# Altium schematic sheet DiffAmp.SchDoc: High Speed Fully Diferential Amplifier
size A; DrawnBy: Enrique Morell; DocumentNumber: 4; Revision: v0.1; SheetNumber: 4; SheetTotal: 9
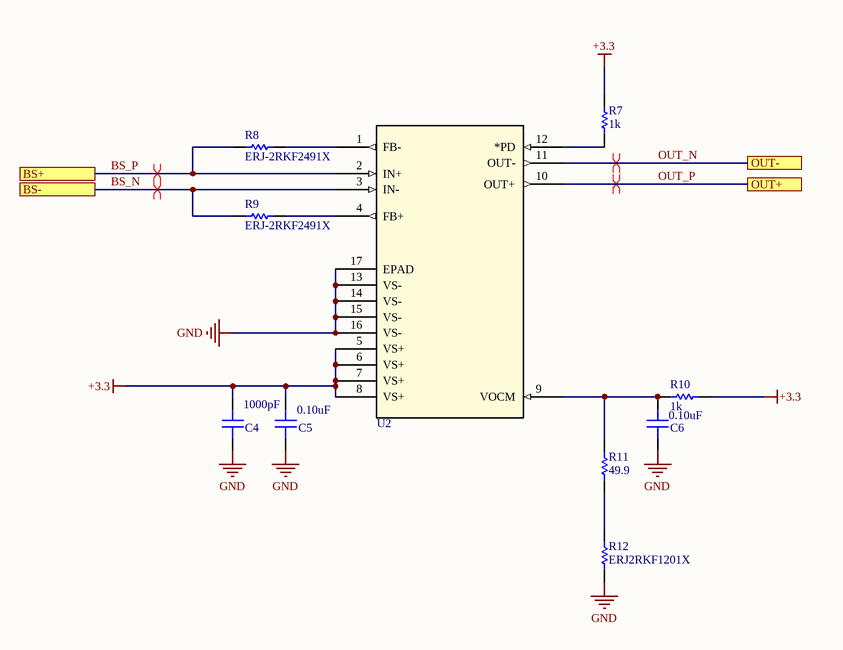
[diagram p0: DiffAmp.SchDoc]

## Parts
C4  1000pF  [CAP 0402/1005]
C5  0.10uF  [CAP 0402/1005]
C6  0.10uF  [CAP 0402/1005]
R7  1k  [RESC1005X40X25NL05T05]
R8  ERJ-2RKF2491X  [RESC1005X40X25ML05T05]
R9  ERJ-2RKF2491X  [RESC1005X40X25ML05T05]
R10  1k  [RESC1005X40X25NL05T05]
R11  49.9  [RESC1005X40X25NL05T05]
R12  ERJ2RKF1201X  [RESC1005X40X25ML05T05]
U2  THS4541IRGTT  [TI VQFN-16 (3x3)]  (value not drawn)

## Ports
BS+, BS-, OUT+, OUT-

## Nets
+3.3: C4.2 C5.2 R7.2 R10.1 U2.5(VS+) U2.6(VS+) U2.7(VS+) U2.8(VS+)
GND: C4.1 C5.1 C6.1 R12.1 U2.13(VS-) U2.14(VS-) U2.15(VS-) U2.16(VS-) U2.17(EPAD)
BS_N: R9.1 U2.3(IN-) ; port BS-
BS_P: R8.1 U2.2(IN+) ; port BS+
OUT_N: U2.11(OUT-) ; port OUT-
OUT_P: U2.10(OUT+) ; port OUT+
NetC6_2: C6.2 R10.2 R11.2 U2.9(VOCM)
NetR7_1: R7.1 U2.12(*PD)
NetR8_2: R8.2 U2.1(FB-)
NetR9_2: R9.2 U2.4(FB+)
NetR11_1: R11.1 R12.2

## Layout directives
differential pair: BS_N, BS_P, OUT_N, OUT_P

## Library data of the parts
C4 = C0402C102K3RACTU: CAP CER 1000PF 25V X7R 0402; Manufacturer: Kemet; TemperatureRange: -55C ~ 125C; Tolerance: 10%; Value: 1000pF; Part Number: C0402C102K3RACTU; PartId: 12420; Supplier 1: Digi-Key; Supplier Part Number 1: 399-1031-2-ND; ComponentLink1Description: Datasheet; ComponentLink1URL: http://www.kemet.com/docfinder?Partnumber=C0402C102K3RACTU; ComponentLink2Description: Digi-Key Listing; ComponentLink2URL: https://www.digikey.com/product-detail/en/kemet/C0402C102K3RACTU/399-1031-2-ND/411033; TemperatureCoefficient: X7R; Voltage: 25V; Price: 0.0037; Device Package: 0402 (1005 Metric)
C5 C6 = GRM155R71C104JA88D: CAP CER 0.1UF 16V X7R 0402; Manufacturer: Murata Electronics North America; TemperatureRange: -55C ~ 125C; Tolerance: 5%; Value: 0.10uF; Part Number: GRM155R71C104JA88D; PartId: 12366; Supplier 1: Digi-Key; Supplier Part Number 1: 490-6327-2-ND; ComponentLink1Description: Datasheet; ComponentLink1URL: http://www.murata.com/~/media/webrenewal/support/library/catalog/products/capacitor/mlcc/c02e.pdf; ComponentLink2Description: Digi-Key Listing; ComponentLink2URL: https://www.digikey.com/product-detail/en/murata-electronics-north-america/GRM155R71C104JA88D/490-6327-2-ND/2610891; TemperatureCoefficient: X7R; Voltage: 16V; Price: 0.0046; Device Package: 0402 (1005 Metric)
R7 R10 = CMP-2002-00606-3: Chip Resistor, 1 KOhm, +/- 1%, 100 mW, -55 to 155 degC, 0402 (1005 Metric), RoHS, Tape and Reel; PartNumber: ERJ-2RKF1001X; Manufacturer: Basic Passives; Voltage Rating: 50 V; Case\/Package: 0402; Resistance: 1 KOhm; Power Rating: 100 mW; DatasheetVersion: 04/2015; Radiation Hardening: No; Pins: 2; Height: 0.35 mm; RoHSCompliant: true; Case Code (Imperial): 0402; ComponentLink2Description: Datasheet; ComponentLink1Description: Manufacturer URL; PackageReference: 0402; Mount: Surface Mount; Package Quantity: 10000; Tolerance: 1%; ComponentLink1URL: http://www.panasonic.com/; PackageDescription: 2-Pin Surface Mount Device, Body 1 x 0.5 mm; Mounting Technology: Surface Mount; Case Code (Metric): 1005; ComponentLink2URL: http://industrial.panasonic.com/cdbs/www-data/pdf/RDA0000/AOA0000C86.pdf; REACH SVHC: Yes; Packaging: Tape and Reel; Max Operating Temperature: 155 degC; Min Operating Temperature: -55 degC; Width: 0.5 mm; Length: 1 mm
R8 = CMP-2002-00805-1: Manufacturer: Panasonic; Part Number: ERJ-2RKF2491X
R9 = CMP-2002-00805-1: 2.49k; Manufacturer: Panasonic; Part Number: ERJ-2RKF2491X
R11 = CMP-2002-00969-1: Manufacturer: Panasonic; Part Number: ERJ-2RKF49R9X
R12 = CMP-2002-01123-1: Manufacturer: Panasonic; Part Number: ERJ2RKF1201X
U2 = THS4541IRGTT: IC OPAMP DIFF 1 CIRCUIT 16VQFN; Built_By: EMA_UL_Team; Vendor: Texas Instruments; Frequency - Transition: 850Mhz; Manufacturer_Part_Number: THS4541IRGTT; Copyright: Copyright (C) 2018 Accelerated Designs. All rights reserved; RefDes: RefDes; Type: DEV; Value: Value; Part Number: THS4541IRGTT; PartId: 9798; Manufacturer: Texas Instruments; Supplier 1: Digi-Key; Supplier Part Number 1: 296-38343-1-ND; ComponentLink1Description: Datasheet; ComponentLink1URL: http://www.ti.com/lit/ds/symlink/ths4541.pdf; ComponentLink2Description: Digi-Key Listing; ComponentLink2URL: https://www.digikey.com/product-detail/en/texas-instruments/THS4541IRGTT/296-38343-1-ND/4968310; Device Package: 16-VFQFN Exposed Pad; Price: 6.57